# Altium schematic sheet EST_MainV20.SchDoc
size B
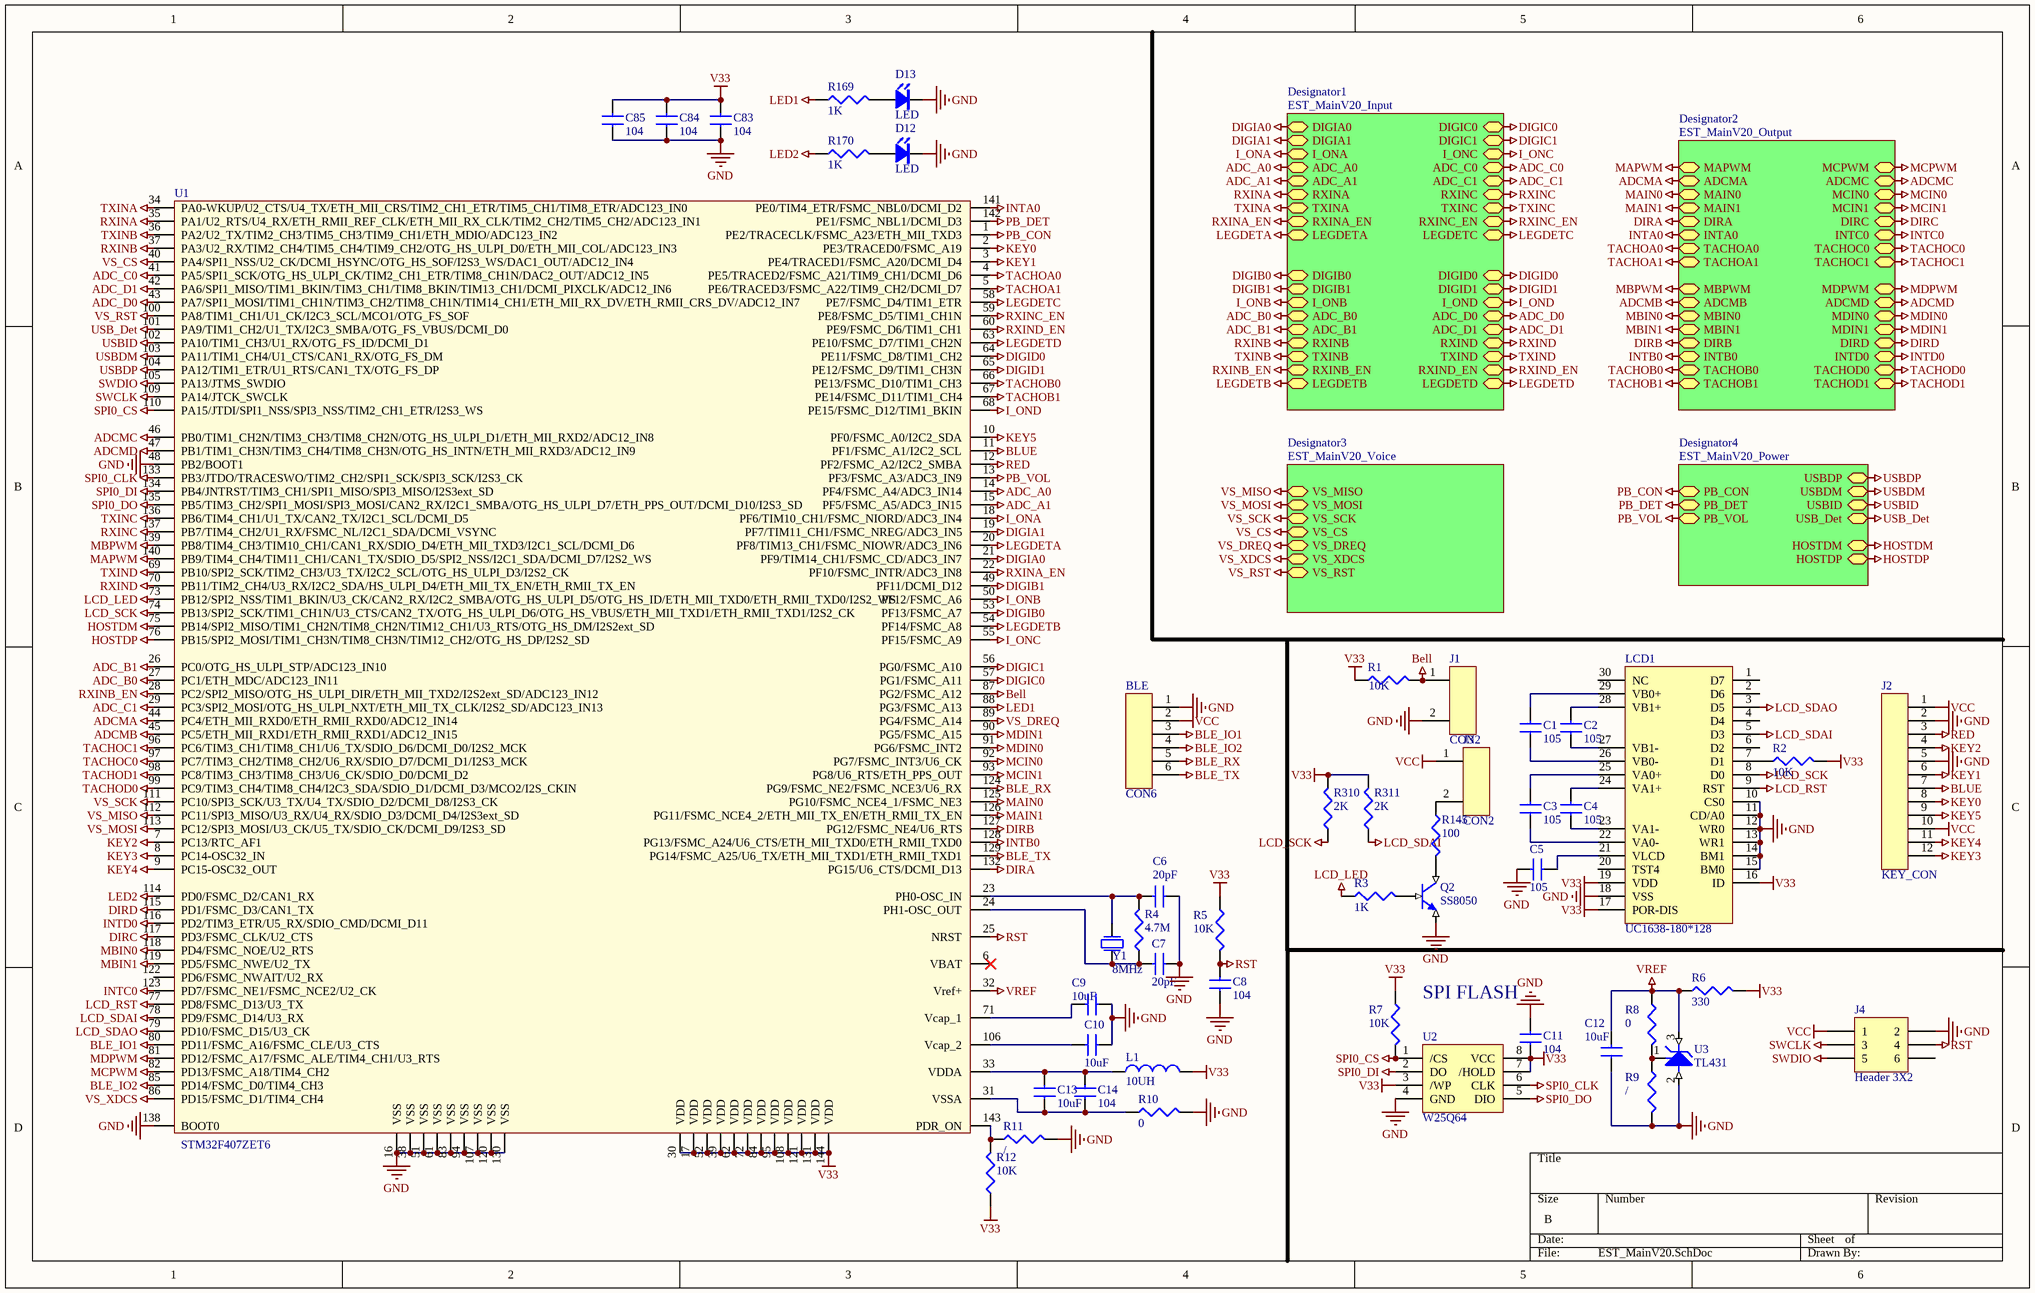
[diagram p0: EST_MainV20.SchDoc]

## Parts
BLE  CON6  [H2_2.0mm_2*3]
C1  105  [CAP_0603]
C2  105  [CAP_0603]
C3  105  [CAP_0603]
C4  105  [CAP_0603]
C5  105  [CAP_0805]
C6  20pF  [CAP_0603]
C7  20pF  [CAP_0603]
C8  104  [CAP_0603]
C9  value 10uF  [CAP_0805]  (hidden comment: 20pF)
C10  value 10uF  [CAP_0805]  (hidden comment: 20pF)
C11  104  [CAP_0603]
C12  value 10uF  [CAP_0805]  (hidden comment: 20pF)
C13  value 10uF  [CAP_0805]  (hidden comment: 20pF)
C14  104  [CAP_0603]
C83  104  [CAP_0603]
C84  104  [CAP_0603]
C85  104  [CAP_0603]
D12  LED  [LED-0603]
D13  LED  [LED-0603]
J1  CON2  [EST_DZ_SW]
J2  KEY_CON  [FPC_12P]
J3  CON2  [SIP2]
J4  Header 3X2  [H2_2.0mm_2*3]
L1  10UH  [0805]
LCD1  UC1638-180*128  [FPC_30P]
Q2  SS8050  [8050SMD]
R1  10K  [RES_0603]
R2  10K  [RES_0603]
R3  1K  [RES_0603]
R4  4.7M  [RES_0603]
R5  10K  [RES_0603]
R6  330  [RES_0603]
R7  10K  [RES_0603]
R8  0  [RES_0603]
R9  /  [RES_0603]
R10  0  [RES_0603]
R11  /  [RES_0603]
R12  10K  [RES_0603]
R145  100  [1206]
R169  1K  [RES_0603]
R170  1K  [RES_0603]
R310  2K  [RES_0603]
R311  2K  [RES_0603]
U1  STM32F407ZET6  [LQFP144]
U2  W25Q64  [WSON8]
U3  TL431  [TL431(SOT23)]
Y1  8MHz  [XTAL_5032]

## Sub-sheets
Designator1 = EST_MainV20_Input: DIGIA0, DIGIA1, I_ONA, ADC_A0, ADC_A1, RXINA, TXINA, RXINA_EN, DIGIC0, DIGIC1, I_ONC, ADC_C0, ADC_C1, RXINC, TXINC, RXINC_EN, DIGIB0, DIGIB1, I_ONB, ADC_B0, ADC_B1, RXINB, TXINB, RXINB_EN, DIGID0, DIGID1, I_OND, ADC_D0, ADC_D1, RXIND, TXIND, RXIND_EN, LEGDETA, LEGDETC, LEGDETB, LEGDETD
Designator2 = EST_MainV20_Output: MAPWM, ADCMA, MAIN0, MAIN1, DIRA, INTA0, MBPWM, ADCMB, MBIN0, MBIN1, DIRB, INTB0, MCPWM, ADCMC, MCIN0, MCIN1, DIRC, INTC0, MDPWM, ADCMD, MDIN0, MDIN1, DIRD, INTD0, TACHOA0, TACHOA1, TACHOB0, TACHOB1, TACHOC0, TACHOC1, TACHOD0, TACHOD1
Designator3 = EST_MainV20_Voice: VS_MISO, VS_MOSI, VS_SCK, VS_CS, VS_DREQ, VS_XDCS, VS_RST
Designator4 = EST_MainV20_Power: PB_CON, PB_DET, PB_VOL, USBDP, USBDM, USBID, USB_Det, HOSTDM, HOSTDP

## Nets
ADC_A0: U1.14(PF4/FSMC_A4/ADC3_IN14) ; sheet Designator1/ADC_A0
ADC_A1: U1.15(PF5/FSMC_A5/ADC3_IN15) ; sheet Designator1/ADC_A1
ADC_B0: U1.27(PC1/ETH_MDC/ADC123_IN11) ; sheet Designator1/ADC_B0
ADC_B1: U1.26(PC0/OTG_HS_ULPI_STP/ADC123_IN10) ; sheet Designator1/ADC_B1
ADC_C0: U1.41(PA5/SPI1_SCK/OTG_HS_ULPI_CK/TIM2_CH1_ETR/TIM8_CH1N/DAC2_OUT/ADC12_IN5) ; sheet Designator1/ADC_C0
ADC_C1: U1.29(PC3/SPI2_MOSI/OTG_HS_ULPI_NXT/ETH_MII_TX_CLK/I2S2_SD/ADC123_IN13) ; sheet Designator1/ADC_C1
ADC_D0: U1.43(PA7/SPI1_MOSI/TIM1_CH1N/TIM3_CH2/TIM8_CH1N/TIM14_CH1/ETH_MII_RX_DV/ETH_RMII_CRS_DV/ADC12_IN7) ; sheet Designator1/ADC_D0
ADC_D1: U1.42(PA6/SPI1_MISO/TIM1_BKIN/TIM3_CH1/TIM8_BKIN/TIM13_CH1/DCMI_PIXCLK/ADC12_IN6) ; sheet Designator1/ADC_D1
ADCMA: U1.44(PC4/ETH_MII_RXD0/ETH_RMII_RXD0/ADC12_IN14) ; sheet Designator2/ADCMA
ADCMB: U1.45(PC5/ETH_MII_RXD1/ETH_RMII_RXD1/ADC12_IN15) ; sheet Designator2/ADCMB
ADCMC: U1.46(PB0/TIM1_CH2N/TIM3_CH3/TIM8_CH2N/OTG_HS_ULPI_D1/ETH_MII_RXD2/ADC12_IN8) ; sheet Designator2/ADCMC
ADCMD: U1.47(PB1/TIM1_CH3N/TIM3_CH4/TIM8_CH3N/OTG_HS_INTN/ETH_MII_RXD3/ADC12_IN9) ; sheet Designator2/ADCMD
Bell: J1.1 R1.1(TOP) U1.87(PG2/FSMC_A12)
BLE_IO1: BLE.3 U1.80(PD11/FSMC_A16/FSMC_CLE/U3_CTS)
BLE_IO2: BLE.4 U1.85(PD14/FSMC_D0/TIM4_CH3)
BLE_RX: BLE.5 U1.124(PG9/FSMC_NE2/FSMC_NCE3/U6_RX)
BLE_TX: BLE.6 U1.129(PG14/FSMC_A25/U6_TX/ETH_MII_TXD1/ETH_RMII_TXD1)
BLUE: J2.7 U1.11(PF1/FSMC_A1/I2C2_SCL)
DIGIA0: U1.21(PF9/TIM14_CH1/FSMC_CD/ADC3_IN7) ; sheet Designator1/DIGIA0
DIGIA1: U1.19(PF7/TIM11_CH1/FSMC_NREG/ADC3_IN5) ; sheet Designator1/DIGIA1
DIGIB0: U1.53(PF13/FSMC_A7) ; sheet Designator1/DIGIB0
DIGIB1: U1.49(PF11/DCMI_D12) ; sheet Designator1/DIGIB1
DIGIC0: U1.57(PG1/FSMC_A11) ; sheet Designator1/DIGIC0
DIGIC1: U1.56(PG0/FSMC_A10) ; sheet Designator1/DIGIC1
DIGID0: U1.64(PE11/FSMC_D8/TIM1_CH2) ; sheet Designator1/DIGID0
DIGID1: U1.65(PE12/FSMC_D9/TIM1_CH3N) ; sheet Designator1/DIGID1
DIRA: U1.132(PG15/U6_CTS/DCMI_D13) ; sheet Designator2/DIRA
DIRB: U1.127(PG12/FSMC_NE4/U6_RTS) ; sheet Designator2/DIRB
DIRC: U1.117(PD3/FSMC_CLK/U2_CTS) ; sheet Designator2/DIRC
DIRD: U1.115(PD1/FSMC_D3/CAN1_TX) ; sheet Designator2/DIRD
GND: BLE.1 C5.1 C6.1 C7.1 C8.1 C9.2 C10.1 C11.1 C12.1 C83.2 C84.2 C85.2 D12.2(K) D13.2(K) J1.2 J2.2 J2.5 J4.2 LCD1.10(CS0) LCD1.11(CD/A0) LCD1.12(WR0) LCD1.13(WR1) LCD1.14(BM1) LCD1.15(BM0) LCD1.18(VSS) Q2.1(E) R9.1(TOP) R10.1(TOP) R11.1(TOP) U1.16(VSS) U1.38(VSS) U1.48(PB2/BOOT1) U1.51(VSS) U1.61(VSS) U1.83(VSS) U1.94(VSS) U1.107(VSS) U1.120(VSS) U1.130(VSS) U1.138(BOOT0) U2.4(GND) U3.2(A)
HOSTDM: U1.75(PB14/SPI2_MISO/TIM1_CH2N/TIM8_CH2N/TIM12_CH1/U3_RTS/OTG_HS_DM/I2S2ext_SD) ; sheet Designator4/HOSTDM
HOSTDP: U1.76(PB15/SPI2_MOSI/TIM1_CH3N/TIM8_CH3N/TIM12_CH2/OTG_HS_DP/I2S2_SD) ; sheet Designator4/HOSTDP
I_ONA: U1.18(PF6/TIM10_CH1/FSMC_NIORD/ADC3_IN4) ; sheet Designator1/I_ONA
I_ONB: U1.50(PF12/FSMC_A6) ; sheet Designator1/I_ONB
I_ONC: U1.55(PF15/FSMC_A9) ; sheet Designator1/I_ONC
I_OND: U1.68(PE15/FSMC_D12/TIM1_BKIN) ; sheet Designator1/I_OND
INTA0: U1.141(PE0/TIM4_ETR/FSMC_NBL0/DCMI_D2) ; sheet Designator2/INTA0
INTB0: U1.128(PG13/FSMC_A24/U6_CTS/ETH_MII_TXD0/ETH_RMII_TXD0) ; sheet Designator2/INTB0
INTC0: U1.123(PD7/FSMC_NE1/FSMC_NCE2/U2_CK) ; sheet Designator2/INTC0
INTD0: U1.116(PD2/TIM3_ETR/U5_RX/SDIO_CMD/DCMI_D11) ; sheet Designator2/INTD0
KEY0: J2.8 U1.2(PE3/TRACED0/FSMC_A19)
KEY1: J2.6 U1.3(PE4/TRACED1/FSMC_A20/DCMI_D4)
KEY2: J2.4 U1.7(PC13/RTC_AF1)
KEY3: J2.12 U1.8(PC14-OSC32_IN)
KEY4: J2.11 U1.9(PC15-OSC32_OUT)
KEY5: J2.9 U1.10(PF0/FSMC_A0/I2C2_SDA)
LCD_LED: R3.2(BOT) U1.73(PB12/SPI2_NSS/TIM1_BKIN/U3_CK/CAN2_RX/I2C2_SMBA/OTG_HS_ULPI_D5/OTG_HS_ID/ETH_MII_TXD0/ETH_RMII_TXD0/I2S2_WS)
LCD_RST: LCD1.9(RST) U1.77(PD8/FSMC_D13/U3_TX)
LCD_SCK: LCD1.8(D0) R310.2(BOT) U1.74(PB13/SPI2_SCK/TIM1_CH1N/U3_CTS/CAN2_TX/OTG_HS_ULPI_D6/OTG_HS_VBUS/ETH_MII_TXD1/ETH_RMII_TXD1/I2S2_CK)
LCD_SDAI: LCD1.5(D3) R311.2(BOT) U1.78(PD9/FSMC_D14/U3_RX)
LCD_SDAO: LCD1.3(D5) U1.79(PD10/FSMC_D15/U3_CK)
LED1: R169.2(BOT) U1.88(PG3/FSMC_A13)
LED2: R170.2(BOT) U1.114(PD0/FSMC_D2/CAN1_RX)
LEGDETA: U1.20(PF8/TIM13_CH1/FSMC_NIOWR/ADC3_IN6) ; sheet Designator1/LEGDETA
LEGDETB: U1.54(PF14/FSMC_A8) ; sheet Designator1/LEGDETB
LEGDETC: U1.58(PE7/FSMC_D4/TIM1_ETR) ; sheet Designator1/LEGDETC
LEGDETD: U1.63(PE10/FSMC_D7/TIM1_CH2N) ; sheet Designator1/LEGDETD
MAIN0: U1.125(PG10/FSMC_NCE4_1/FSMC_NE3) ; sheet Designator2/MAIN0
MAIN1: U1.126(PG11/FSMC_NCE4_2/ETH_MII_TX_EN/ETH_RMII_TX_EN) ; sheet Designator2/MAIN1
MAPWM: U1.140(PB9/TIM4_CH4/TIM11_CH1/CAN1_TX/SDIO_D5/SPI2_NSS/I2C1_SDA/DCMI_D7/I2S2_WS) ; sheet Designator2/MAPWM
MBIN0: U1.118(PD4/FSMC_NOE/U2_RTS) ; sheet Designator2/MBIN0
MBIN1: U1.119(PD5/FSMC_NWE/U2_TX) ; sheet Designator2/MBIN1
MBPWM: U1.139(PB8/TIM4_CH3/TIM10_CH1/CAN1_RX/SDIO_D4/ETH_MII_TXD3/I2C1_SCL/DCMI_D6) ; sheet Designator2/MBPWM
MCIN0: U1.92(PG7/FSMC_INT3/U6_CK) ; sheet Designator2/MCIN0
MCIN1: U1.93(PG8/U6_RTS/ETH_PPS_OUT) ; sheet Designator2/MCIN1
MCPWM: U1.82(PD13/FSMC_A18/TIM4_CH2) ; sheet Designator2/MCPWM
MDIN0: U1.91(PG6/FSMC_INT2) ; sheet Designator2/MDIN0
MDIN1: U1.90(PG5/FSMC_A15) ; sheet Designator2/MDIN1
MDPWM: U1.81(PD12/FSMC_A17/FSMC_ALE/TIM4_CH1/U3_RTS) ; sheet Designator2/MDPWM
PB_CON: U1.1(PE2/TRACECLK/FSMC_A23/ETH_MII_TXD3) ; sheet Designator4/PB_CON
PB_DET: U1.142(PE1/FSMC_NBL1/DCMI_D3) ; sheet Designator4/PB_DET
PB_VOL: U1.13(PF3/FSMC_A3/ADC3_IN9) ; sheet Designator4/PB_VOL
RED: J2.3 U1.12(PF2/FSMC_A2/I2C2_SMBA)
RST: C8.2 J4.4 R5.1(TOP) U1.25(NRST)
RXINA: U1.35(PA1/U2_RTS/U4_RX/ETH_RMII_REF_CLK/ETH_MII_RX_CLK/TIM2_CH2/TIM5_CH2/ADC123_IN1) ; sheet Designator1/RXINA
RXINA_EN: U1.22(PF10/FSMC_INTR/ADC3_IN8) ; sheet Designator1/RXINA_EN
RXINB: U1.37(PA3/U2_RX/TIM2_CH4/TIM5_CH4/TIM9_CH2/OTG_HS_ULPI_D0/ETH_MII_COL/ADC123_IN3) ; sheet Designator1/RXINB
RXINB_EN: U1.28(PC2/SPI2_MISO/OTG_HS_ULPI_DIR/ETH_MII_TXD2/I2S2ext_SD/ADC123_IN12) ; sheet Designator1/RXINB_EN
RXINC: U1.137(PB7/TIM4_CH2/U1_RX/FSMC_NL/I2C1_SDA/DCMI_VSYNC) ; sheet Designator1/RXINC
RXINC_EN: U1.59(PE8/FSMC_D5/TIM1_CH1N) ; sheet Designator1/RXINC_EN
RXIND: U1.70(PB11/TIM2_CH4/U3_RX/I2C2_SDA/HS_ULPI_D4/ETH_MII_TX_EN/ETH_RMII_TX_EN) ; sheet Designator1/RXIND
RXIND_EN: U1.60(PE9/FSMC_D6/TIM1_CH1) ; sheet Designator1/RXIND_EN
SPI0_CLK: U1.133(PB3/JTDO/TRACESWO/TIM2_CH2/SPI1_SCK/SPI3_SCK/I2S3_CK) U2.6(CLK)
SPI0_CS: R7.1(TOP) U1.110(PA15/JTDI/SPI1_NSS/SPI3_NSS/TIM2_CH1_ETR/I2S3_WS) U2.1(/CS)
SPI0_DI: U1.134(PB4/JNTRST/TIM3_CH1/SPI1_MISO/SPI3_MISO/I2S3ext_SD) U2.2(DO)
SPI0_DO: U1.135(PB5/TIM3_CH2/SPI1_MOSI/SPI3_MOSI/CAN2_RX/I2C1_SMBA/OTG_HS_ULPI_D7/ETH_PPS_OUT/DCMI_D10/I2S3_SD) U2.5(DIO)
SWCLK: J4.3 U1.109(PA14/JTCK_SWCLK)
SWDIO: J4.5 U1.105(PA13/JTMS_SWDIO)
TACHOA0: U1.4(PE5/TRACED2/FSMC_A21/TIM9_CH1/DCMI_D6) ; sheet Designator2/TACHOA0
TACHOA1: U1.5(PE6/TRACED3/FSMC_A22/TIM9_CH2/DCMI_D7) ; sheet Designator2/TACHOA1
TACHOB0: U1.66(PE13/FSMC_D10/TIM1_CH3) ; sheet Designator2/TACHOB0
TACHOB1: U1.67(PE14/FSMC_D11/TIM1_CH4) ; sheet Designator2/TACHOB1
TACHOC0: U1.97(PC7/TIM3_CH2/TIM8_CH2/U6_RX/SDIO_D7/DCMI_D1/I2S3_MCK) ; sheet Designator2/TACHOC0
TACHOC1: U1.96(PC6/TIM3_CH1/TIM8_CH1/U6_TX/SDIO_D6/DCMI_D0/I2S2_MCK) ; sheet Designator2/TACHOC1
TACHOD0: U1.99(PC9/TIM3_CH4/TIM8_CH4/I2C3_SDA/SDIO_D1/DCMI_D3/MCO2/I2S_CKIN) ; sheet Designator2/TACHOD0
TACHOD1: U1.98(PC8/TIM3_CH3/TIM8_CH3/U6_CK/SDIO_D0/DCMI_D2) ; sheet Designator2/TACHOD1
TXINA: U1.34(PA0-WKUP/U2_CTS/U4_TX/ETH_MII_CRS/TIM2_CH1_ETR/TIM5_CH1/TIM8_ETR/ADC123_IN0) ; sheet Designator1/TXINA
TXINB: U1.36(PA2/U2_TX/TIM2_CH3/TIM5_CH3/TIM9_CH1/ETH_MDIO/ADC123_IN2) ; sheet Designator1/TXINB
TXINC: U1.136(PB6/TIM4_CH1/U1_TX/CAN2_TX/I2C1_SCL/DCMI_D5) ; sheet Designator1/TXINC
TXIND: U1.69(PB10/SPI2_SCK/TIM2_CH3/U3_TX/I2C2_SCL/OTG_HS_ULPI_D3/I2S2_CK) ; sheet Designator1/TXIND
USB_Det: U1.101(PA9/TIM1_CH2/U1_TX/I2C3_SMBA/OTG_FS_VBUS/DCMI_D0) ; sheet Designator4/USB_Det
USBDM: U1.103(PA11/TIM1_CH4/U1_CTS/CAN1_RX/OTG_FS_DM) ; sheet Designator4/USBDM
USBDP: U1.104(PA12/TIM1_ETR/U1_RTS/CAN1_TX/OTG_FS_DP) ; sheet Designator4/USBDP
USBID: U1.102(PA10/TIM1_CH3/U1_RX/OTG_FS_ID/DCMI_D1) ; sheet Designator4/USBID
V33: C11.2 C83.1 C84.1 C85.1 L1.2 LCD1.16(ID) LCD1.17(POR-DIS) LCD1.19(VDD) R1.2(BOT) R2.1(TOP) R5.2(BOT) R6.1(TOP) R7.2(BOT) R12.2(BOT) R310.1(TOP) R311.1(TOP) U1.17(VDD) U1.30(VDD) U1.39(VDD) U1.52(VDD) U1.62(VDD) U1.72(VDD) U1.84(VDD) U1.95(VDD) U1.108(VDD) U1.121(VDD) U1.131(VDD) U1.144(VDD) U2.3(/WP) U2.7(/HOLD) U2.8(VCC)
VCC: BLE.2 J2.1 J2.10 J3.1 J4.1
VREF: C12.2 R6.2(BOT) R8.2(BOT) U1.32(Vref+) U3.3(K)
VS_CS: U1.40(PA4/SPI1_NSS/U2_CK/DCMI_HSYNC/OTG_HS_SOF/I2S3_WS/DAC1_OUT/ADC12_IN4) ; sheet Designator3/VS_CS
VS_DREQ: U1.89(PG4/FSMC_A14) ; sheet Designator3/VS_DREQ
VS_MISO: U1.112(PC11/SPI3_MISO/U3_RX/U4_RX/SDIO_D3/DCMI_D4/I2S3ext_SD) ; sheet Designator3/VS_MISO
VS_MOSI: U1.113(PC12/SPI3_MOSI/U3_CK/U5_TX/SDIO_CK/DCMI_D9/I2S3_SD) ; sheet Designator3/VS_MOSI
VS_RST: U1.100(PA8/TIM1_CH1/U1_CK/I2C3_SCL/MCO1/OTG_FS_SOF) ; sheet Designator3/VS_RST
VS_SCK: U1.111(PC10/SPI3_SCK/U3_TX/U4_TX/SDIO_D2/DCMI_D8/I2S3_CK) ; sheet Designator3/VS_SCK
VS_XDCS: U1.86(PD15/FSMC_D1/TIM4_CH4) ; sheet Designator3/VS_XDCS
NetC1_1: C1.1 LCD1.29(VB0+)
NetC1_2: C1.2 LCD1.26(VB0-)
NetC2_1: C2.1 LCD1.28(VB1+)
NetC2_2: C2.2 LCD1.27(VB1-)
NetC3_1: C3.1 LCD1.25(VA0+)
NetC3_2: C3.2 LCD1.22(VA0-)
NetC4_1: C4.1 LCD1.24(VA1+)
NetC4_2: C4.2 LCD1.23(VA1-)
NetC5_2: C5.2 LCD1.21(VLCD)
NetC6_2: C6.2 R4.2(BOT) U1.23(PH0-OSC_IN) Y1.1(P1)
NetC7_2: C7.2 R4.1(TOP) U1.24(PH1-OSC_OUT) Y1.2(P2)
NetC9_1: C9.1 U1.71(Vcap_1)
NetC10_2: C10.2 U1.106(Vcap_2)
NetC13_1: C13.1 C14.2 R10.2(BOT) U1.31(VSSA)
NetC13_2: C13.2 C14.1 L1.1 U1.33(VDDA)
NetD12_1: D12.1(A) R170.1(TOP)
NetD13_1: D13.1(A) R169.1(TOP)
NetJ3_2: J3.2 R145.2(BOT)
NetLCD1_7: LCD1.7(D1) R2.2(BOT)
NetQ2_2: Q2.2(B) R3.1(TOP)
NetQ2_3: Q2.3(C) R145.1(TOP)
NetR8_1: R8.1(TOP) R9.2(BOT) U3.1(R)
NetR11_2: R11.2(BOT) R12.1(TOP) U1.143(PDR_ON)

Not connected (* = marked no-connect by the designer): J4 6; LCD1 1(D7) 2(D6) 4(D4) 6(D2) 20(TST4) 30(NC); U1 6(VBAT)* 122(PD6/FSMC_NWAIT/U2_RX)

## Notes on the sheet
- SPI FLASH

## Library data of the parts
C1-C14 C83-C85 = CAP: Capacitor
  C6 C7: Value: 20pF
J1 J3 = CON2: SOCKET
J2 = CON12: SOCKET
J4 = Header 3X2: Header, 3-Pin, Dual row; LatestRevisionDate: 17-Jul-2002; LatestRevisionNote: Re-released for DXP Platform.; Publisher: Altium Limited
L1 = INDUCTOR
LCD1 = UC1638
Q2 = NPN: triode
R1-R12 R145 R169 R170 R310 R311 = RES: Resistor
U2 = 25P16
U3 = TL431: Adjustable Precision Shunt Regulator
Y1 = XTAL: CRYSTAL